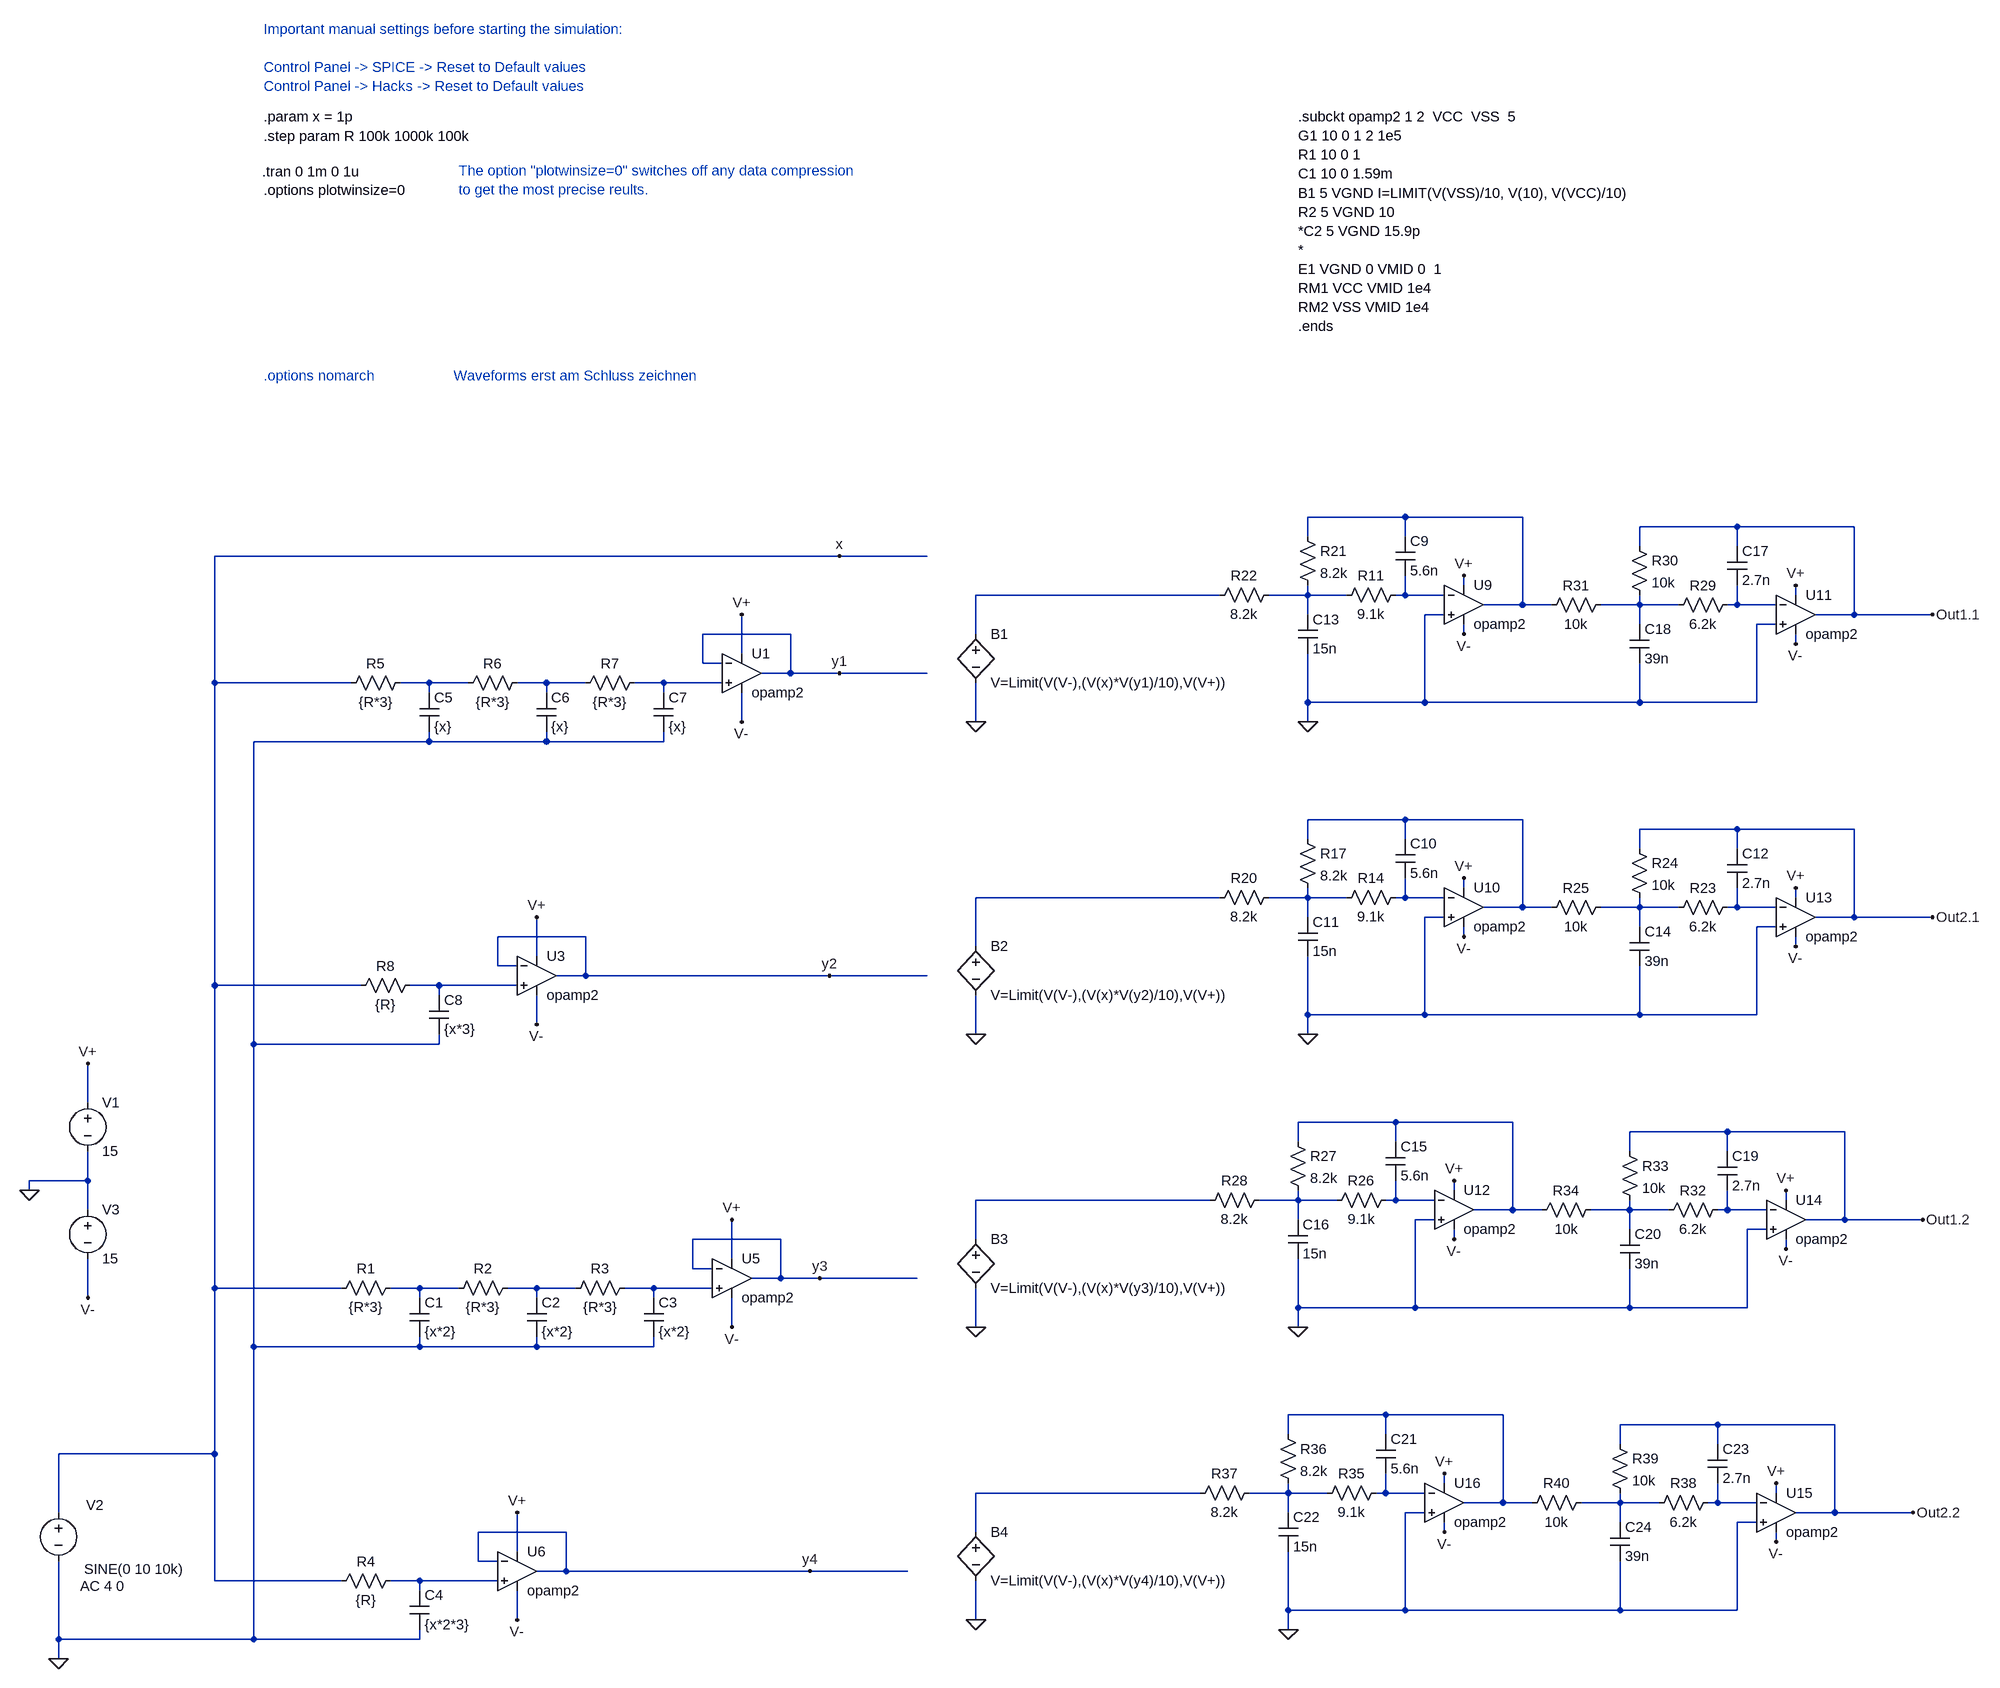
[diagram p0: schematic voll_leer_Kanal7_3.asc]
voll_leer_Kanal7_3.asc, the LTspice schematic file:
Version 4
SHEET 1 4732 680
WIRE -368 -176 -368 -192
WIRE -320 352 -320 256
WIRE -320 560 -320 432
WIRE -320 592 -320 560
WIRE -272 -320 -272 -384
WIRE -272 -192 -368 -192
WIRE -272 -192 -272 -240
WIRE -272 -144 -272 -192
WIRE -272 0 -272 -64
WIRE -64 -1008 -64 -1216
WIRE -64 -512 -64 -1008
WIRE -64 -16 -64 -512
WIRE -64 256 -320 256
WIRE -64 256 -64 -16
WIRE -64 464 -64 256
WIRE 0 -416 0 -912
WIRE 0 80 0 -416
WIRE 0 560 -320 560
WIRE 0 560 0 80
WIRE 144 -16 -64 -16
WIRE 144 464 -64 464
WIRE 160 -1008 -64 -1008
WIRE 176 -512 -64 -512
WIRE 272 -16 224 -16
WIRE 272 0 272 -16
WIRE 272 80 0 80
WIRE 272 80 272 64
WIRE 272 464 224 464
WIRE 272 480 272 464
WIRE 272 560 0 560
WIRE 272 560 272 544
WIRE 288 -1008 240 -1008
WIRE 288 -992 288 -1008
WIRE 288 -912 0 -912
WIRE 288 -912 288 -928
WIRE 304 -512 256 -512
WIRE 304 -496 304 -512
WIRE 304 -416 0 -416
WIRE 304 -416 304 -432
WIRE 336 -16 272 -16
WIRE 352 -1008 288 -1008
WIRE 368 432 368 384
WIRE 400 -544 400 -592
WIRE 400 432 368 432
WIRE 400 464 272 464
WIRE 432 -544 400 -544
WIRE 432 -512 304 -512
WIRE 432 416 432 352
WIRE 432 528 432 480
WIRE 464 -560 464 -624
WIRE 464 -448 464 -496
WIRE 464 -16 416 -16
WIRE 464 0 464 -16
WIRE 464 80 272 80
WIRE 464 80 464 64
WIRE 480 -1008 432 -1008
WIRE 480 -992 480 -1008
WIRE 480 -912 288 -912
WIRE 480 -912 480 -928
WIRE 512 384 368 384
WIRE 512 448 464 448
WIRE 512 448 512 384
WIRE 528 -16 464 -16
WIRE 544 -1008 480 -1008
WIRE 544 -592 400 -592
WIRE 544 -528 496 -528
WIRE 544 -528 544 -592
WIRE 656 -16 608 -16
WIRE 656 0 656 -16
WIRE 656 80 464 80
WIRE 656 80 656 64
WIRE 672 -1008 624 -1008
WIRE 672 -992 672 -1008
WIRE 672 -912 480 -912
WIRE 672 -912 672 -928
WIRE 720 -48 720 -96
WIRE 736 -1040 736 -1088
WIRE 752 -48 720 -48
WIRE 752 -16 656 -16
WIRE 768 -1040 736 -1040
WIRE 768 -1008 672 -1008
WIRE 784 -64 784 -128
WIRE 784 48 784 0
WIRE 800 -1056 800 -1120
WIRE 800 -944 800 -992
WIRE 864 -96 720 -96
WIRE 864 -32 816 -32
WIRE 864 -32 864 -96
WIRE 880 -1088 736 -1088
WIRE 880 -1024 832 -1024
WIRE 880 -1024 880 -1088
WIRE 912 448 512 448
WIRE 928 -32 864 -32
WIRE 944 -528 544 -528
WIRE 960 -1216 -64 -1216
WIRE 960 -1024 880 -1024
WIRE 1072 448 912 448
WIRE 1088 -32 928 -32
WIRE 1104 -1216 960 -1216
WIRE 1104 -1024 960 -1024
WIRE 1104 -528 944 -528
WIRE 1184 -1088 1184 -1152
WIRE 1184 -944 1184 -1008
WIRE 1184 -576 1184 -656
WIRE 1184 -432 1184 -496
WIRE 1184 -96 1184 -160
WIRE 1184 48 1184 -16
WIRE 1184 384 1184 320
WIRE 1184 528 1184 464
WIRE 1552 320 1184 320
WIRE 1568 -160 1184 -160
WIRE 1584 -1152 1184 -1152
WIRE 1584 -656 1184 -656
WIRE 1696 224 1696 192
WIRE 1696 320 1632 320
WIRE 1696 320 1696 304
WIRE 1696 352 1696 320
WIRE 1696 512 1696 416
WIRE 1696 544 1696 512
WIRE 1712 -256 1712 -288
WIRE 1712 -160 1648 -160
WIRE 1712 -160 1712 -176
WIRE 1712 -128 1712 -160
WIRE 1712 16 1712 -64
WIRE 1712 48 1712 16
WIRE 1728 -1248 1728 -1280
WIRE 1728 -1152 1664 -1152
WIRE 1728 -1152 1728 -1168
WIRE 1728 -1120 1728 -1152
WIRE 1728 -976 1728 -1056
WIRE 1728 -944 1728 -976
WIRE 1728 -752 1728 -784
WIRE 1728 -656 1664 -656
WIRE 1728 -656 1728 -672
WIRE 1728 -624 1728 -656
WIRE 1728 -464 1728 -560
WIRE 1728 -432 1728 -464
WIRE 1760 320 1696 320
WIRE 1776 -160 1712 -160
WIRE 1792 -1152 1728 -1152
WIRE 1792 -656 1728 -656
WIRE 1856 192 1696 192
WIRE 1856 224 1856 192
WIRE 1856 320 1840 320
WIRE 1856 320 1856 288
WIRE 1872 -288 1712 -288
WIRE 1872 -256 1872 -288
WIRE 1872 -160 1856 -160
WIRE 1872 -160 1872 -192
WIRE 1888 -1280 1728 -1280
WIRE 1888 -1248 1888 -1280
WIRE 1888 -1152 1872 -1152
WIRE 1888 -1152 1888 -1184
WIRE 1888 -784 1728 -784
WIRE 1888 -752 1888 -784
WIRE 1888 -656 1872 -656
WIRE 1888 -656 1888 -688
WIRE 1888 512 1696 512
WIRE 1888 512 1888 352
WIRE 1904 16 1712 16
WIRE 1904 16 1904 -128
WIRE 1920 -976 1728 -976
WIRE 1920 -976 1920 -1120
WIRE 1920 -464 1728 -464
WIRE 1920 -464 1920 -624
WIRE 1920 320 1856 320
WIRE 1920 352 1888 352
WIRE 1936 -160 1872 -160
WIRE 1936 -128 1904 -128
WIRE 1952 -1152 1888 -1152
WIRE 1952 -1120 1920 -1120
WIRE 1952 -656 1888 -656
WIRE 1952 -624 1920 -624
WIRE 1952 304 1952 288
WIRE 1952 384 1952 368
WIRE 1968 -176 1968 -192
WIRE 1968 -96 1968 -112
WIRE 1984 -1168 1984 -1184
WIRE 1984 -1088 1984 -1104
WIRE 1984 -672 1984 -688
WIRE 1984 -592 1984 -608
WIRE 2048 192 1856 192
WIRE 2048 336 1984 336
WIRE 2048 336 2048 192
WIRE 2064 -288 1872 -288
WIRE 2064 -144 2000 -144
WIRE 2064 -144 2064 -288
WIRE 2080 -1280 1888 -1280
WIRE 2080 -1136 2016 -1136
WIRE 2080 -1136 2080 -1280
WIRE 2080 -784 1888 -784
WIRE 2080 -640 2016 -640
WIRE 2080 -640 2080 -784
WIRE 2096 336 2048 336
WIRE 2112 -144 2064 -144
WIRE 2128 -1136 2080 -1136
WIRE 2128 -640 2080 -640
WIRE 2240 240 2240 208
WIRE 2240 336 2176 336
WIRE 2240 336 2240 320
WIRE 2240 368 2240 336
WIRE 2240 512 1888 512
WIRE 2240 512 2240 432
WIRE 2256 -240 2256 -272
WIRE 2256 -144 2192 -144
WIRE 2256 -144 2256 -160
WIRE 2256 -112 2256 -144
WIRE 2256 16 1904 16
WIRE 2256 16 2256 -48
WIRE 2272 -1232 2272 -1264
WIRE 2272 -1136 2208 -1136
WIRE 2272 -1136 2272 -1152
WIRE 2272 -1104 2272 -1136
WIRE 2272 -976 1920 -976
WIRE 2272 -976 2272 -1040
WIRE 2272 -736 2272 -768
WIRE 2272 -640 2208 -640
WIRE 2272 -640 2272 -656
WIRE 2272 -608 2272 -640
WIRE 2272 -464 1920 -464
WIRE 2272 -464 2272 -544
WIRE 2304 336 2240 336
WIRE 2320 -144 2256 -144
WIRE 2336 -1136 2272 -1136
WIRE 2336 -640 2272 -640
WIRE 2400 208 2240 208
WIRE 2400 240 2400 208
WIRE 2400 336 2384 336
WIRE 2400 336 2400 304
WIRE 2416 -272 2256 -272
WIRE 2416 -240 2416 -272
WIRE 2416 -144 2400 -144
WIRE 2416 -144 2416 -176
WIRE 2432 -1264 2272 -1264
WIRE 2432 -1232 2432 -1264
WIRE 2432 -1136 2416 -1136
WIRE 2432 -1136 2432 -1168
WIRE 2432 -768 2272 -768
WIRE 2432 -736 2432 -768
WIRE 2432 -640 2416 -640
WIRE 2432 -640 2432 -672
WIRE 2432 512 2240 512
WIRE 2432 512 2432 368
WIRE 2448 16 2256 16
WIRE 2448 16 2448 -112
WIRE 2464 -976 2272 -976
WIRE 2464 -976 2464 -1104
WIRE 2464 -464 2272 -464
WIRE 2464 -464 2464 -608
WIRE 2464 336 2400 336
WIRE 2464 368 2432 368
WIRE 2480 -144 2416 -144
WIRE 2480 -112 2448 -112
WIRE 2496 -1136 2432 -1136
WIRE 2496 -1104 2464 -1104
WIRE 2496 -640 2432 -640
WIRE 2496 -608 2464 -608
WIRE 2496 320 2496 304
WIRE 2496 400 2496 384
WIRE 2512 -160 2512 -176
WIRE 2512 -80 2512 -96
WIRE 2528 -1152 2528 -1168
WIRE 2528 -1072 2528 -1088
WIRE 2528 -656 2528 -672
WIRE 2528 -576 2528 -592
WIRE 2592 208 2400 208
WIRE 2592 352 2528 352
WIRE 2592 352 2592 208
WIRE 2608 -272 2416 -272
WIRE 2608 -128 2544 -128
WIRE 2608 -128 2608 -272
WIRE 2624 -1264 2432 -1264
WIRE 2624 -1120 2560 -1120
WIRE 2624 -1120 2624 -1264
WIRE 2624 -768 2432 -768
WIRE 2624 -624 2560 -624
WIRE 2624 -624 2624 -768
WIRE 2720 352 2592 352
WIRE 2736 -128 2608 -128
WIRE 2752 -1120 2624 -1120
WIRE 2752 -624 2624 -624
FLAG -320 592 0
FLAG -368 -176 0
FLAG -272 0 V-
FLAG -272 -384 V+
FLAG 800 -1120 V+
FLAG 800 -944 V-
FLAG 464 -624 V+
FLAG 464 -448 V-
FLAG 2752 -1120 Out1.1
FLAG 784 -128 V+
FLAG 784 48 V-
FLAG 432 352 V+
FLAG 432 528 V-
FLAG 1984 -1184 V+
FLAG 1984 -1088 V-
FLAG 2528 -1168 V+
FLAG 2528 -1072 V-
FLAG 2752 -624 Out2.1
FLAG 1984 -688 V+
FLAG 1984 -592 V-
FLAG 2528 -672 V+
FLAG 2528 -576 V-
FLAG 2736 -128 Out1.2
FLAG 1968 -192 V+
FLAG 1968 -96 V-
FLAG 2512 -176 V+
FLAG 2512 -80 V-
FLAG 2720 352 Out2.2
FLAG 1952 288 V+
FLAG 1952 384 V-
FLAG 2496 304 V+
FLAG 2496 400 V-
FLAG 960 -1024 y1
FLAG 944 -528 y2
FLAG 928 -32 y3
FLAG 912 448 y4
FLAG 960 -1216 x
FLAG 1184 -944 0
FLAG 1184 -432 0
FLAG 1184 48 0
FLAG 1184 528 0
FLAG 1728 -944 0
FLAG 1728 -432 0
FLAG 1712 48 0
FLAG 1696 544 0
SYMBOL res 256 -1024 R90
WINDOW 0 0 56 VBottom 0
WINDOW 3 32 56 VTop 0
SYMATTR InstName R5
SYMATTR Value {R*3}
SYMBOL cap 272 -992 R0
SYMATTR InstName C5
SYMATTR Value {x}
SYMBOL res 448 -1024 R90
WINDOW 0 0 56 VBottom 0
WINDOW 3 32 56 VTop 0
SYMATTR InstName R6
SYMATTR Value {R*3}
SYMBOL cap 464 -992 R0
SYMATTR InstName C6
SYMATTR Value {x}
SYMBOL res 640 -1024 R90
WINDOW 0 0 56 VBottom 0
WINDOW 3 32 56 VTop 0
SYMATTR InstName R7
SYMATTR Value {R*3}
SYMBOL cap 656 -992 R0
SYMATTR InstName C7
SYMATTR Value {x}
SYMBOL voltage -320 336 M0
WINDOW 123 -109 137 Left 0
WINDOW 39 0 0 Left 0
WINDOW 0 -75 4 Left 0
WINDOW 3 -207 109 Left 0
SYMATTR Value2 AC 4 0
SYMATTR InstName V2
SYMATTR Value SINE(0 10 10k)
SYMBOL res 272 -528 R90
WINDOW 0 0 56 VBottom 0
WINDOW 3 32 56 VTop 0
SYMATTR InstName R8
SYMATTR Value {R}
SYMBOL cap 288 -496 R0
SYMATTR InstName C8
SYMATTR Value {x*3}
SYMBOL voltage -272 -336 R0
WINDOW 123 0 0 Left 0
WINDOW 39 24 44 Left 0
SYMATTR InstName V1
SYMATTR Value 15
SYMBOL voltage -272 -160 R0
WINDOW 123 0 0 Left 0
WINDOW 39 24 44 Left 0
SYMATTR InstName V3
SYMATTR Value 15
SYMBOL res 240 -32 R90
WINDOW 0 0 56 VBottom 0
WINDOW 3 32 56 VTop 0
SYMATTR InstName R1
SYMATTR Value {R*3}
SYMBOL cap 256 0 R0
SYMATTR InstName C1
SYMATTR Value {x*2}
SYMBOL res 432 -32 R90
WINDOW 0 0 56 VBottom 0
WINDOW 3 32 56 VTop 0
SYMATTR InstName R2
SYMATTR Value {R*3}
SYMBOL cap 448 0 R0
SYMATTR InstName C2
SYMATTR Value {x*2}
SYMBOL res 624 -32 R90
WINDOW 0 0 56 VBottom 0
WINDOW 3 32 56 VTop 0
SYMATTR InstName R3
SYMATTR Value {R*3}
SYMBOL cap 640 0 R0
SYMATTR InstName C3
SYMATTR Value {x*2}
SYMBOL res 240 448 R90
WINDOW 0 0 56 VBottom 0
WINDOW 3 32 56 VTop 0
SYMATTR InstName R4
SYMATTR Value {R}
SYMBOL cap 256 480 R0
SYMATTR InstName C4
SYMATTR Value {x*2*3}
SYMBOL res 1888 -1168 R90
WINDOW 0 0 56 VBottom 0
WINDOW 3 32 56 VTop 0
SYMATTR InstName R11
SYMATTR Value 9.1k
SYMBOL cap 1872 -1248 R0
SYMATTR InstName C9
SYMATTR Value 5.6n
SYMBOL res 1712 -1264 R0
SYMATTR InstName R21
SYMATTR Value 8.2k
SYMBOL res 1680 -1168 R90
WINDOW 0 0 56 VBottom 0
WINDOW 3 32 56 VTop 0
SYMATTR InstName R22
SYMATTR Value 8.2k
SYMBOL cap 1712 -1120 R0
SYMATTR InstName C13
SYMATTR Value 15n
SYMBOL res 2432 -1152 R90
WINDOW 0 0 56 VBottom 0
WINDOW 3 32 56 VTop 0
SYMATTR InstName R29
SYMATTR Value 6.2k
SYMBOL cap 2416 -1232 R0
SYMATTR InstName C17
SYMATTR Value 2.7n
SYMBOL res 2256 -1248 R0
SYMATTR InstName R30
SYMATTR Value 10k
SYMBOL res 2224 -1152 R90
WINDOW 0 0 56 VBottom 0
WINDOW 3 32 56 VTop 0
SYMATTR InstName R31
SYMATTR Value 10k
SYMBOL cap 2256 -1104 R0
SYMATTR InstName C18
SYMATTR Value 39n
SYMBOL res 1888 -672 R90
WINDOW 0 0 56 VBottom 0
WINDOW 3 32 56 VTop 0
SYMATTR InstName R14
SYMATTR Value 9.1k
SYMBOL cap 1872 -752 R0
SYMATTR InstName C10
SYMATTR Value 5.6n
SYMBOL res 1712 -768 R0
SYMATTR InstName R17
SYMATTR Value 8.2k
SYMBOL res 1680 -672 R90
WINDOW 0 0 56 VBottom 0
WINDOW 3 32 56 VTop 0
SYMATTR InstName R20
SYMATTR Value 8.2k
SYMBOL cap 1712 -624 R0
SYMATTR InstName C11
SYMATTR Value 15n
SYMBOL res 2432 -656 R90
WINDOW 0 0 56 VBottom 0
WINDOW 3 32 56 VTop 0
SYMATTR InstName R23
SYMATTR Value 6.2k
SYMBOL cap 2416 -736 R0
SYMATTR InstName C12
SYMATTR Value 2.7n
SYMBOL res 2256 -752 R0
SYMATTR InstName R24
SYMATTR Value 10k
SYMBOL res 2224 -656 R90
WINDOW 0 0 56 VBottom 0
WINDOW 3 32 56 VTop 0
SYMATTR InstName R25
SYMATTR Value 10k
SYMBOL cap 2256 -608 R0
SYMATTR InstName C14
SYMATTR Value 39n
SYMBOL res 1872 -176 R90
WINDOW 0 0 56 VBottom 0
WINDOW 3 32 56 VTop 0
SYMATTR InstName R26
SYMATTR Value 9.1k
SYMBOL cap 1856 -256 R0
SYMATTR InstName C15
SYMATTR Value 5.6n
SYMBOL res 1696 -272 R0
SYMATTR InstName R27
SYMATTR Value 8.2k
SYMBOL res 1664 -176 R90
WINDOW 0 0 56 VBottom 0
WINDOW 3 32 56 VTop 0
SYMATTR InstName R28
SYMATTR Value 8.2k
SYMBOL cap 1696 -128 R0
SYMATTR InstName C16
SYMATTR Value 15n
SYMBOL res 2416 -160 R90
WINDOW 0 0 56 VBottom 0
WINDOW 3 32 56 VTop 0
SYMATTR InstName R32
SYMATTR Value 6.2k
SYMBOL cap 2400 -240 R0
SYMATTR InstName C19
SYMATTR Value 2.7n
SYMBOL res 2240 -256 R0
SYMATTR InstName R33
SYMATTR Value 10k
SYMBOL res 2208 -160 R90
WINDOW 0 0 56 VBottom 0
WINDOW 3 32 56 VTop 0
SYMATTR InstName R34
SYMATTR Value 10k
SYMBOL cap 2240 -112 R0
SYMATTR InstName C20
SYMATTR Value 39n
SYMBOL res 1856 304 R90
WINDOW 0 0 56 VBottom 0
WINDOW 3 32 56 VTop 0
SYMATTR InstName R35
SYMATTR Value 9.1k
SYMBOL cap 1840 224 R0
SYMATTR InstName C21
SYMATTR Value 5.6n
SYMBOL res 1680 208 R0
SYMATTR InstName R36
SYMATTR Value 8.2k
SYMBOL res 1648 304 R90
WINDOW 0 0 56 VBottom 0
WINDOW 3 32 56 VTop 0
SYMATTR InstName R37
SYMATTR Value 8.2k
SYMBOL cap 1680 352 R0
SYMATTR InstName C22
SYMATTR Value 15n
SYMBOL res 2400 320 R90
WINDOW 0 0 56 VBottom 0
WINDOW 3 32 56 VTop 0
SYMATTR InstName R38
SYMATTR Value 6.2k
SYMBOL cap 2384 240 R0
SYMATTR InstName C23
SYMATTR Value 2.7n
SYMBOL res 2224 224 R0
SYMATTR InstName R39
SYMATTR Value 10k
SYMBOL res 2192 320 R90
WINDOW 0 0 56 VBottom 0
WINDOW 3 32 56 VTop 0
SYMATTR InstName R40
SYMATTR Value 10k
SYMBOL cap 2224 368 R0
SYMATTR InstName C24
SYMATTR Value 39n
SYMBOL Opamps\\opamp2 800 -1088 R0
SYMATTR InstName U1
SYMBOL Opamps\\opamp2 464 -592 R0
SYMATTR InstName U3
SYMBOL Opamps\\opamp2 784 -96 R0
SYMATTR InstName U5
SYMBOL Opamps\\opamp2 432 384 R0
SYMATTR InstName U6
SYMBOL Opamps\\opamp2 1984 -1200 R0
SYMATTR InstName U9
SYMBOL Opamps\\opamp2 1984 -704 R0
SYMATTR InstName U10
SYMBOL Opamps\\opamp2 1968 -208 R0
SYMATTR InstName U12
SYMBOL Opamps\\opamp2 2528 -1184 R0
SYMATTR InstName U11
SYMBOL Opamps\\opamp2 2528 -688 R0
SYMATTR InstName U13
SYMBOL Opamps\\opamp2 2512 -192 R0
SYMATTR InstName U14
SYMBOL Opamps\\opamp2 2496 288 R0
SYMATTR InstName U15
SYMBOL Opamps\\opamp2 1952 272 R0
SYMATTR InstName U16
SYMBOL bv 1184 -1104 R0
SYMATTR InstName B1
SYMATTR Value V=Limit(V(V-),(V(x)*V(y1)/10),V(V+))
SYMBOL bv 1184 -592 R0
SYMATTR InstName B2
SYMATTR Value V=Limit(V(V-),(V(x)*V(y2)/10),V(V+))
SYMBOL bv 1184 -112 R0
SYMATTR InstName B3
SYMATTR Value V=Limit(V(V-),(V(x)*V(y3)/10),V(V+))
SYMBOL bv 1184 368 R0
SYMATTR InstName B4
SYMATTR Value V=Limit(V(V-),(V(x)*V(y4)/10),V(V+))
TEXT 16 -1904 Left 0 !.step param R 100k 1000k 100k
TEXT 16 -1512 Left 0 ;.options nomarch
TEXT 14 -1846 Left 0 !.tran 0 1m 0 1u
TEXT 16 -1816 Left 0 !.options plotwinsize=0
TEXT 336 -1848 Left 0 ;The option "plotwinsize=0" switches off any data compression \nto get the most precise reults.
TEXT 328 -1512 Left 0 ;Waveforms erst am Schluss zeichnen
TEXT 16 -1936 Left 0 !.param x = 1p
TEXT 1712 -1936 Left 0 !.subckt opamp2 1 2  VCC  VSS  5\nG1 10 0 1 2 1e5\nR1 10 0 1\nC1 10 0 1.59m\nB1 5 VGND I=LIMIT(V(VSS)/10, V(10), V(VCC)/10)\nR2 5 VGND 10\n*C2 5 VGND 15.9p\n*\nE1 VGND 0 VMID 0  1\nRM1 VCC VMID 1e4\nRM2 VSS VMID 1e4\n.ends
TEXT 16 -2080 Left 0 ;Important manual settings before starting the simulation:\n \nControl Panel -> SPICE -> Reset to Default values\nControl Panel -> Hacks -> Reset to Default values

The netlist it stands for:
* voll_leer_Kanal7_3.asc
R5 N003 x {R*3}
C5 N003 0 {x}
R6 N006 N003 {R*3}
C6 N006 0 {x}
R7 N008 N006 {R*3}
C7 N008 0 {x}
V2 x 0 SINE(0 10 10k) AC 4 0
R8 N004 x {R}
C8 N004 0 {x*3}
V1 V+ 0 15
V3 0 V- 15
R1 N001 x {R*3}
C1 N001 0 {x*2}
R2 N005 N001 {R*3}
C2 N005 0 {x*2}
R3 N007 N005 {R*3}
C3 N007 0 {x*2}
R4 N002 x {R}
C4 N002 0 {x*2*3}
R11 N023 N018 9.1k
C9 N017 N023 5.6n
R21 N017 N018 8.2k
R22 N018 N009 8.2k
C13 N018 0 15n
R29 N031 N027 6.2k
C17 Out1.1 N031 2.7n
R30 Out1.1 N027 10k
R31 N027 N017 10k
C18 N027 0 39n
R14 N024 N020 9.1k
C10 N019 N024 5.6n
R17 N019 N020 8.2k
R20 N020 N010 8.2k
C11 N020 0 15n
R23 N032 N028 6.2k
C12 Out2.1 N032 2.7n
R24 Out2.1 N028 10k
R25 N028 N019 10k
C14 N028 0 39n
R26 N022 N016 9.1k
C15 N015 N022 5.6n
R27 N015 N016 8.2k
R28 N016 N011 8.2k
C16 N016 0 15n
R32 N030 N026 6.2k
C19 Out1.2 N030 2.7n
R33 Out1.2 N026 10k
R34 N026 N015 10k
C20 N026 0 39n
R35 N021 N014 9.1k
C21 N013 N021 5.6n
R36 N013 N014 8.2k
R37 N014 N012 8.2k
C22 N014 0 15n
R38 N029 N025 6.2k
C23 Out2.2 N029 2.7n
R39 Out2.2 N025 10k
R40 N025 N013 10k
C24 N025 0 39n
XU1 N008 y1 V+ V- y1 opamp2  ; pins In+ In- V+ V- OUT
XU3 N004 y2 V+ V- y2 opamp2  ; pins In+ In- V+ V- OUT
XU5 N007 y3 V+ V- y3 opamp2  ; pins In+ In- V+ V- OUT
XU6 N002 y4 V+ V- y4 opamp2  ; pins In+ In- V+ V- OUT
XU9 0 N023 V+ V- N017 opamp2  ; pins In+ In- V+ V- OUT
XU10 0 N024 V+ V- N019 opamp2  ; pins In+ In- V+ V- OUT
XU12 0 N022 V+ V- N015 opamp2  ; pins In+ In- V+ V- OUT
XU11 0 N031 V+ V- Out1.1 opamp2  ; pins In+ In- V+ V- OUT
XU13 0 N032 V+ V- Out2.1 opamp2  ; pins In+ In- V+ V- OUT
XU14 0 N030 V+ V- Out1.2 opamp2  ; pins In+ In- V+ V- OUT
XU15 0 N029 V+ V- Out2.2 opamp2  ; pins In+ In- V+ V- OUT
XU16 0 N021 V+ V- N013 opamp2  ; pins In+ In- V+ V- OUT
B1 N009 0 V=Limit(V(V-),(V(x)*V(y1)/10),V(V+))
B2 N010 0 V=Limit(V(V-),(V(x)*V(y2)/10),V(V+))
B3 N011 0 V=Limit(V(V-),(V(x)*V(y3)/10),V(V+))
B4 N012 0 V=Limit(V(V-),(V(x)*V(y4)/10),V(V+))
.step param R 100k 1000k 100k
* .options nomarch
.tran 0 1m 0 1u
.options plotwinsize=0
* The option "plotwinsize=0" switches off any data compression
* to get the most precise reults.
* Waveforms erst am Schluss zeichnen
.param x = 1p
.subckt opamp2 1 2  VCC  VSS  5
G1 10 0 1 2 1e5
R1 10 0 1
C1 10 0 1.59m
B1 5 VGND I=LIMIT(V(VSS)/10, V(10), V(VCC)/10)
R2 5 VGND 10
*C2 5 VGND 15.9p
*
E1 VGND 0 VMID 0  1
RM1 VCC VMID 1e4
RM2 VSS VMID 1e4
.ends
* Important manual settings before starting the simulation:
* Control Panel -> SPICE -> Reset to Default values
* Control Panel -> Hacks -> Reset to Default values
.backanno
.end